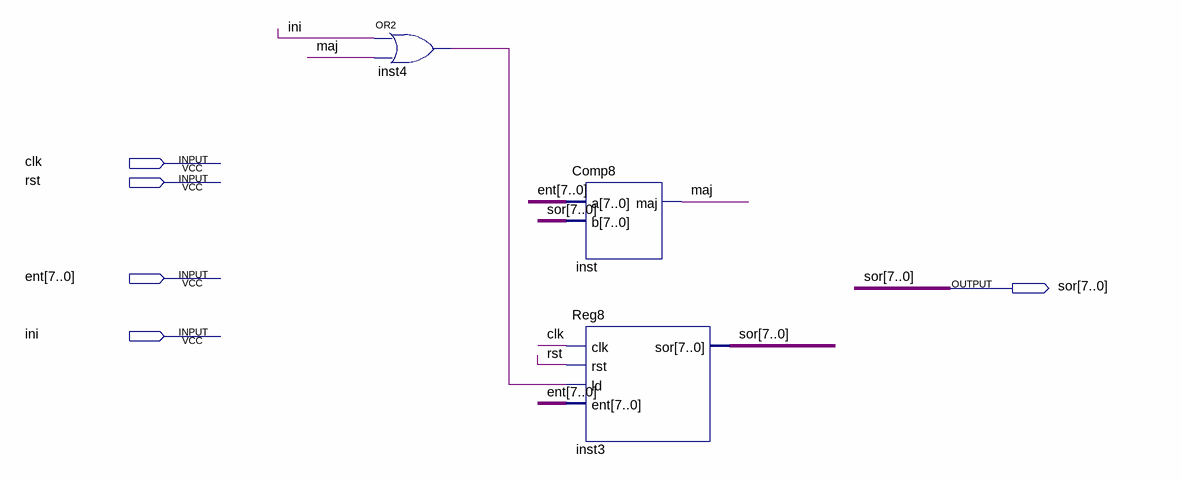
[diagram p0: schematic sheet]
// Quartus schematic max.bdf as structural Verilog: 3 symbols, 5 pins
module max (
  input  clk,
  input  rst,
  input  [7:0] ent,
  input  ini,
  output [7:0] sor
);

  wire inst4_out, maj;

  or inst4 (inst4_out, ini, maj);
  Comp8 inst (.a(ent), .b(sor), .maj(maj));
  Reg8 inst3 (.clk(clk), .rst(rst), .ld(inst4_out), .ent(ent), .sor(sor));
endmodule
